# Altium schematic sheet bob_breakout-top.SchDoc
size A4; SheetNumber: 1; SheetTotal: 7
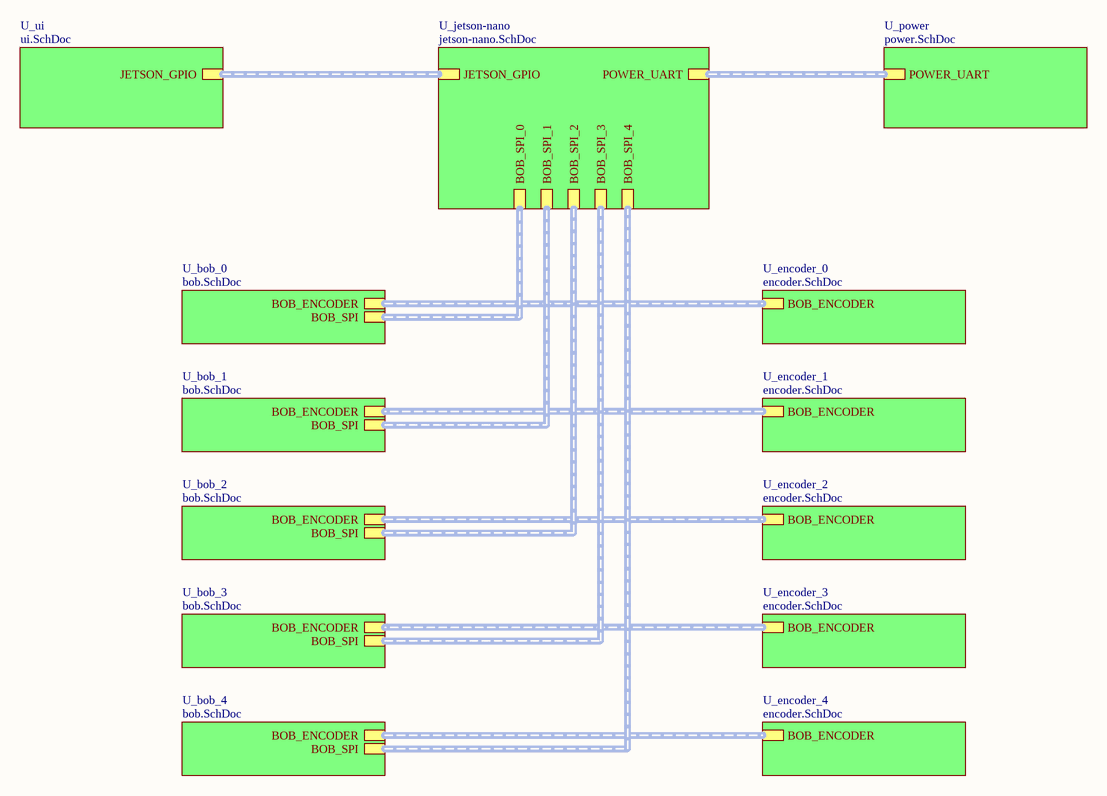
[diagram p0: bob_breakout-top.SchDoc]

## Sub-sheets
U_bob_0 = bob.SchDoc: BOB_ENCODER (harness BOB_ENCODER), BOB_SPI (harness BOB_SPI)
U_bob_1 = bob.SchDoc: BOB_ENCODER (harness BOB_ENCODER), BOB_SPI (harness BOB_SPI)
U_bob_2 = bob.SchDoc: BOB_ENCODER (harness BOB_ENCODER), BOB_SPI (harness BOB_SPI)
U_bob_3 = bob.SchDoc: BOB_ENCODER (harness BOB_ENCODER), BOB_SPI (harness BOB_SPI)
U_bob_4 = bob.SchDoc: BOB_ENCODER (harness BOB_ENCODER), BOB_SPI (harness BOB_SPI)
U_encoder_0 = encoder.SchDoc: BOB_ENCODER (harness BOB_ENCODER)
U_encoder_1 = encoder.SchDoc: BOB_ENCODER (harness BOB_ENCODER)
U_encoder_2 = encoder.SchDoc: BOB_ENCODER (harness BOB_ENCODER)
U_encoder_3 = encoder.SchDoc: BOB_ENCODER (harness BOB_ENCODER)
U_encoder_4 = encoder.SchDoc: BOB_ENCODER (harness BOB_ENCODER)
U_jetson-nano = jetson-nano.SchDoc: BOB_SPI_2 (harness BOB_SPI), BOB_SPI_0 (harness BOB_SPI), BOB_SPI_4 (harness BOB_SPI), BOB_SPI_3 (harness BOB_SPI), BOB_SPI_1 (harness BOB_SPI), JETSON_GPIO (harness JETSON_GPIO), POWER_UART (harness POWER_UART)
U_power = power.SchDoc: POWER_UART (harness POWER_UART)
U_ui = ui.SchDoc: JETSON_GPIO (harness JETSON_GPIO)

## Buses and harness runs
harness sheet U_bob_0/BOB_ENCODER = sheet U_encoder_0/BOB_ENCODER
harness sheet U_bob_0/BOB_SPI = sheet U_jetson-nano/BOB_SPI_0
harness sheet U_bob_1/BOB_ENCODER = sheet U_encoder_1/BOB_ENCODER
harness sheet U_bob_1/BOB_SPI = sheet U_jetson-nano/BOB_SPI_1
harness sheet U_bob_2/BOB_ENCODER = sheet U_encoder_2/BOB_ENCODER
harness sheet U_bob_2/BOB_SPI = sheet U_jetson-nano/BOB_SPI_2
harness sheet U_bob_3/BOB_ENCODER = sheet U_encoder_3/BOB_ENCODER
harness sheet U_bob_3/BOB_SPI = sheet U_jetson-nano/BOB_SPI_3
harness sheet U_bob_4/BOB_ENCODER = sheet U_encoder_4/BOB_ENCODER
harness sheet U_bob_4/BOB_SPI = sheet U_jetson-nano/BOB_SPI_4
harness sheet U_jetson-nano/JETSON_GPIO = sheet U_ui/JETSON_GPIO
harness sheet U_jetson-nano/POWER_UART = sheet U_power/POWER_UART